# EasyEDA schematic schematic.json
TITLE: Sheet_2; REV: 1.0; Date: 2024-08-19; Sheet: 1/1; Drawn By: anirudh_sahu_12; Company: Your Company
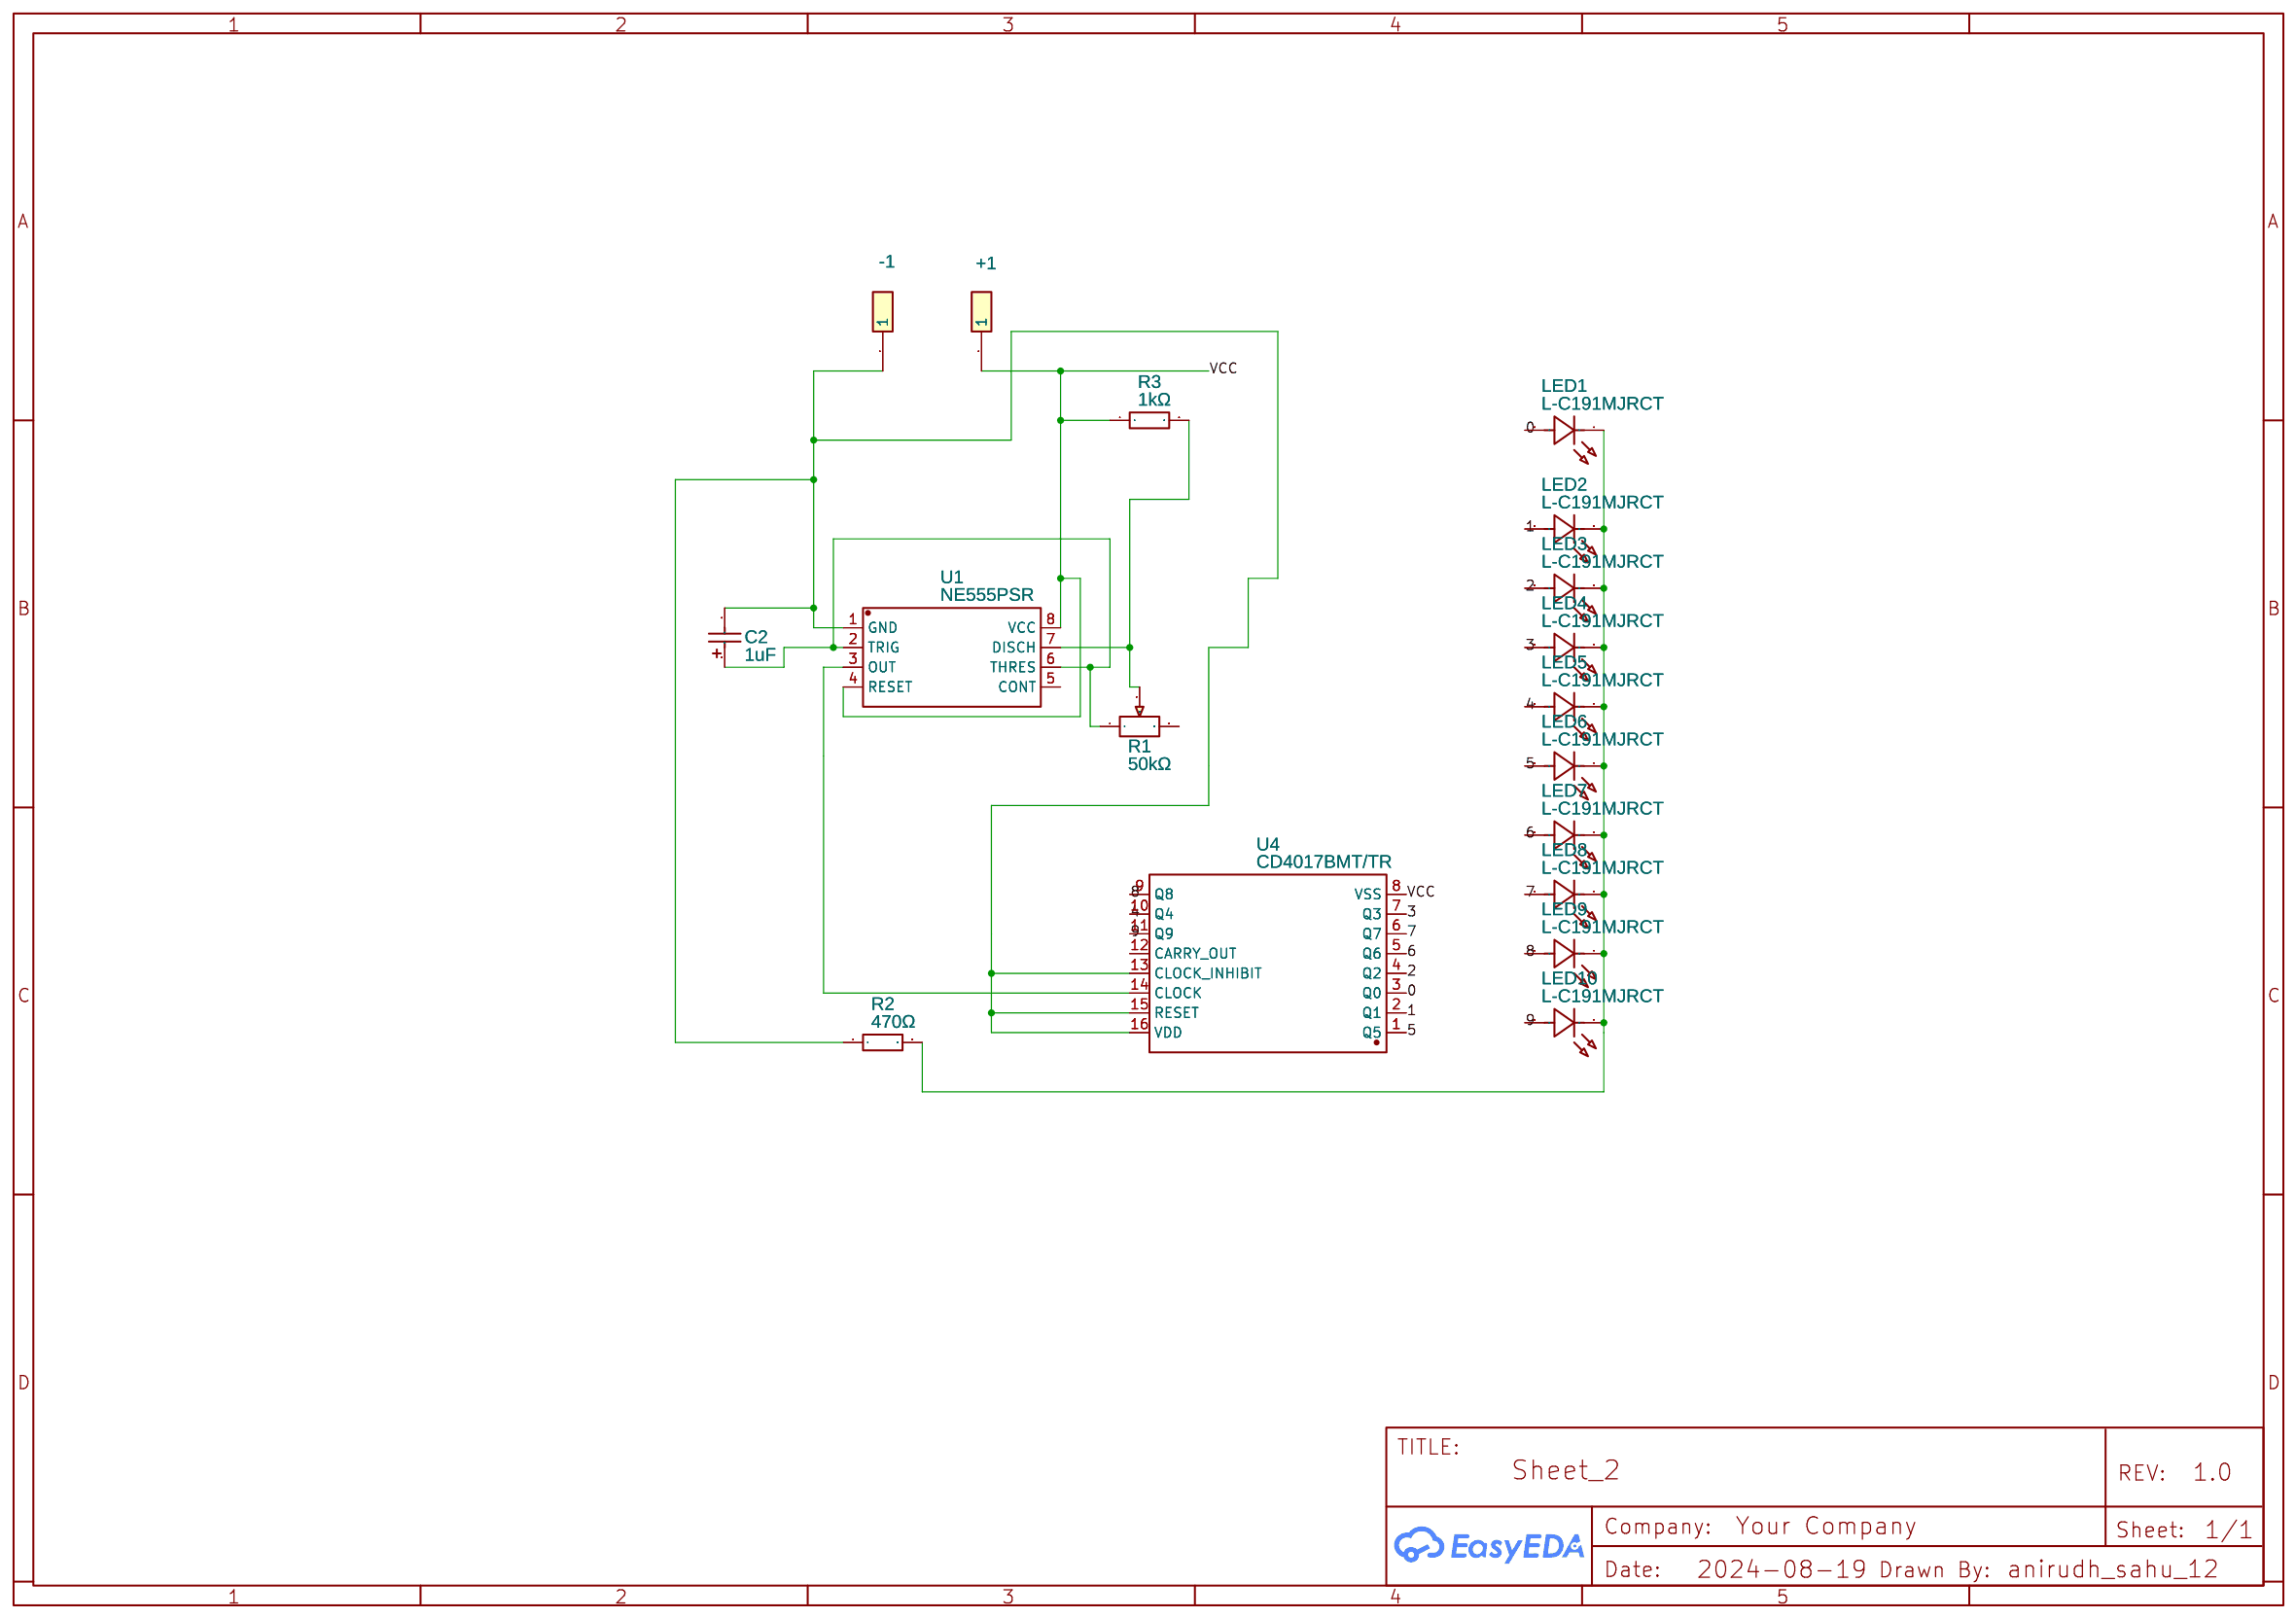
[diagram p0: schematic sheet]

## Parts
+1  Header-Male-2.54_1x1  [HDR-1X1/2.54]
-1  Header-Male-2.54_1x1  [HDR-1X1/2.54]
C2  1uF  [CAP-SMD_L3.5-W2.8]
LED1  L-C191MJRCT  [LED0603-RD_RED]
LED2  L-C191MJRCT  [LED0603-RD_RED]
LED3  L-C191MJRCT  [LED0603-RD_RED]
LED4  L-C191MJRCT  [LED0603-RD_RED]
LED5  L-C191MJRCT  [LED0603-RD_RED]
LED6  L-C191MJRCT  [LED0603-RD_RED]
LED7  L-C191MJRCT  [LED0603-RD_RED]
LED8  L-C191MJRCT  [LED0603-RD_RED]
LED9  L-C191MJRCT  [LED0603-RD_RED]
LED10  L-C191MJRCT  [LED0603-RD_RED]
R1  50kΩ  [RES-ADJ-TH_3P-L7.1-W6.9-P2.50-L_3362P]
R2  470Ω  [RES-TH_BD2.2-L6.5-P10.50-D0.6]
R3  1kΩ  [RES-TH_BD2.5-L6.5-P10.50-D0.6]
U1  NE555PSR  [SOIC-8_L6.2-W5.3-P1.27-LS8.0-BL]
U4  CD4017BMT/TR  [TSSOP-16_L5.0-W4.4-P0.65-LS6.4-BL]

## Library data of the parts
+1 -1 = -: Supplier: LCSC; Manufacturer: LCSC; Supplier Part: C81276
C2 = TAJB105K050RNJ: Supplier: LCSC; Manufacturer: Kyocera AVX; Supplier Part: C72109; JLCPCB Part Class: Extended Part
LED1-LED10 = L-C191MJRCT: Contributor: lcsc; Supplier: LCSC; Supplier Part: C2962776; Manufacturer: PARALIGHT(光鼎); JLCPCB Part Class: Extended Part
R1 = 3362P-1-503: Resistance(Ohms): 50K; Contributor: LCSC; Supplier: LCSC; Supplier Part: C118910; Manufacturer: BOCHEN(博晨); JLCPCB Part Class: Extended Part
R2 = MFR0W4F4700A50: Supplier: LCSC; Manufacturer: UNI-ROYAL(厚声); Supplier Part: C58592; JLCPCB Part Class: Extended Part
R3 = MFR0W4F1001A50: Supplier: LCSC; Manufacturer: UNI-ROYAL(厚声); Supplier Part: C57435; JLCPCB Part Class: Extended Part
U1 = NE555PSR: Contributor: LCSC; Supplier: LCSC; Supplier Part: C105601; Manufacturer: TI(德州仪器); JLCPCB Part Class: Extended Part
U4 = CD4017BMT/TR: Contributor: lcsc; Supplier: LCSC; Supplier Part: C5160080; Manufacturer: HGSEMI(华冠); JLCPCB Part Class: Extended Part

## Nets
VCC: +1.1 R3.1 U1.4(RESET) U1.8(VCC) U4.8(VSS)
0: LED1.2(A) U4.3(Q0)
1: LED2.2(A) U4.2(Q1)
2: LED3.2(A) U4.4(Q2)
3: LED4.2(A) U4.7(Q3)
4: LED5.2(A) U4.10(Q4)
5: LED6.2(A) U4.1(Q5)
6: LED7.2(A) U4.5(Q6)
7: LED8.2(A) U4.6(Q7)
8: LED9.2(A) U4.9(Q8)
9: LED10.2(A) U4.11(Q9)
Net-(-1-1): -1.1 C2.2 R2.1 U1.1(GND) U4.13(CLOCK INHIBIT) U4.15(RESET) U4.16(VDD)
Net-(C2-1): C2.1 R1.1 U1.2(TRIG) U1.6(THRES)
Net-(LED1-1): LED1.1(K) LED2.1(K) LED3.1(K) LED4.1(K) LED5.1(K) LED6.1(K) LED7.1(K) LED8.1(K) LED9.1(K) LED10.1(K) R2.2
Net-(R1-2): R1.2 R3.2 U1.7(DISCH)
Net-(U1-3): U1.3(OUT) U4.14(CLOCK)

Not connected (* = marked no-connect by the designer): R1 3; U1 5(CONT); U4 12(CARRY OUT)
